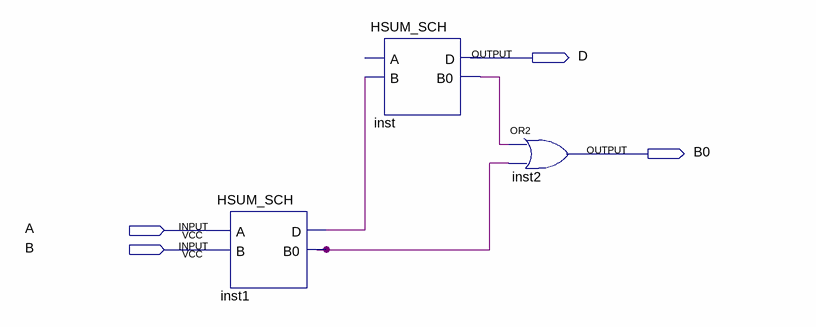
[diagram p0: schematic sheet]
// Quartus schematic FSUM_SHM.bdf as structural Verilog: 3 symbols, 4 pins
module FSUM_SHM (
  input  A,
  input  B,
  output D,
  output B0
);

  wire inst1_b0, inst1_d, inst_b0;

  HSUM_SCH inst1 (.D(inst1_d), .B0(inst1_b0));  // open: A, B
  HSUM_SCH inst (.B(inst1_d), .B0(inst_b0));  // open: A, D
  or inst2 (B0, inst_b0, inst1_b0);
endmodule
